# EAGLE schematic Motorsystem (EAGLE 9.5.2)

## Sheet 1 of 2
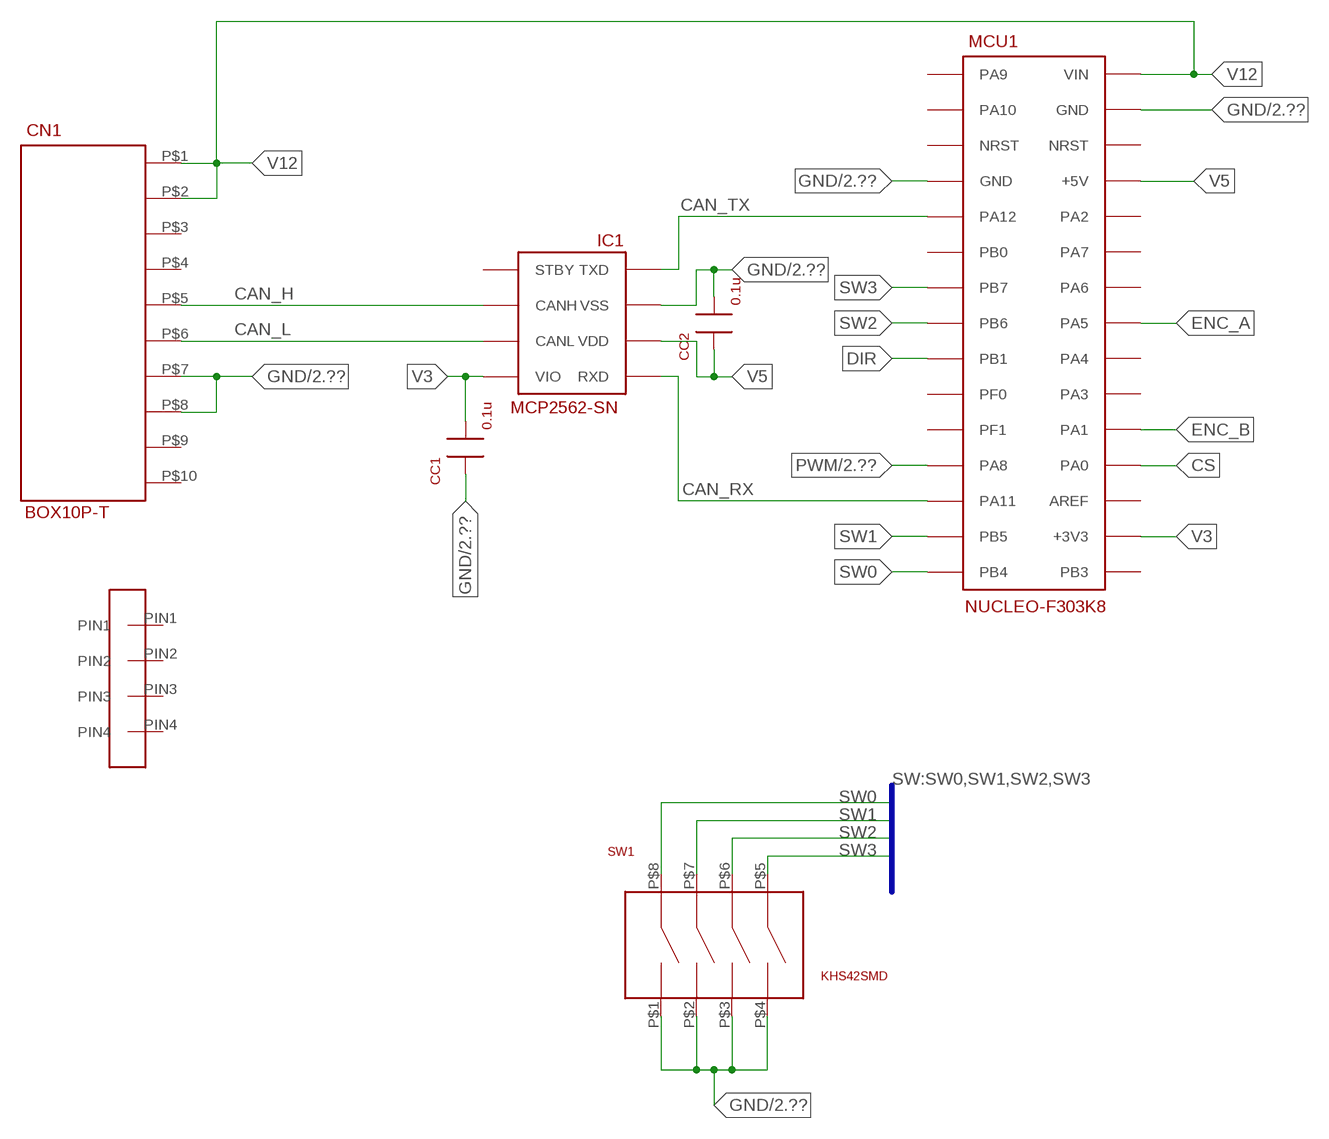
[diagram p0: schematic, sheet 1]

### Parts
CC1  0.1u  MLCC1608  [C1608]
CC2  0.1u  MLCC1608  [C1608]
CN1  BOX10P-T  [BOX10P-T]
IC1  MCP2562-SN  [SOIC8]
MCU1  NUCLEO-F303K8  [NUCLEO-NANO]
SW1  KHS42SMD  [KHS42]
U$3  DF1B_L_4P  [DF1B_L_4P]

### Nets
CAN_H [signal]: CN1.P$5 IC1.P$7(CANH)
CAN_L [signal]: CN1.P$6 IC1.P$6(CANL)
CAN_RX [signal]: IC1.P$4(RXD) MCU1.P$13(PA11)
CAN_TX [signal]: IC1.P$1(TXD) MCU1.P$5(PA12)
CS: MCU1.P$19(PA0)
DIR [signal]: MCU1.P$9(PB1)
ENC_A: MCU1.P$23(PA5)
ENC_B: MCU1.P$20(PA1)
GND [GND]: CC1.P$1 CC2.P$2 CN1.P$7 CN1.P$8 IC1.P$2(VSS) MCU1.P$4(GND) MCU1.P$29(GND) SW1.P$1 SW1.P$2 SW1.P$3 SW1.P$4 ; also sheet 2
PWM: MCU1.P$12(PA8) ; also sheet 2
SW0: MCU1.P$15(PB4) SW1.P$8
SW1: MCU1.P$14(PB5) SW1.P$7
SW2: MCU1.P$8(PB6) SW1.P$6
SW3: MCU1.P$7(PB7) SW1.P$5
V3 [Power]: CC1.P$2 IC1.P$5(VIO) MCU1.P$17(+3V3)
V5 [Power]: CC2.P$1 IC1.P$3(VDD) MCU1.P$27(+5V)
V12 [Power]: CN1.P$1 CN1.P$2 MCU1.P$30(VIN)
Unconnected: CN1.P$3 CN1.P$4 CN1.P$9 CN1.P$10 IC1.P$8(STBY) MCU1.P$1(PA9) MCU1.P$2(PA10) MCU1.P$3(NRST) MCU1.P$6(PB0) MCU1.P$10(PF0) MCU1.P$11(PF1) MCU1.P$16(PB3) MCU1.P$18(AREF) MCU1.P$21(PA3) MCU1.P$22(PA4) MCU1.P$24(PA6) MCU1.P$25(PA7) MCU1.P$26(PA2) MCU1.P$28(NRST) U$3.PIN1 U$3.PIN2 U$3.PIN3 U$3.PIN4

### Buses
SW:SW0,SW1,SW2,SW3

## Sheet 2 of 2
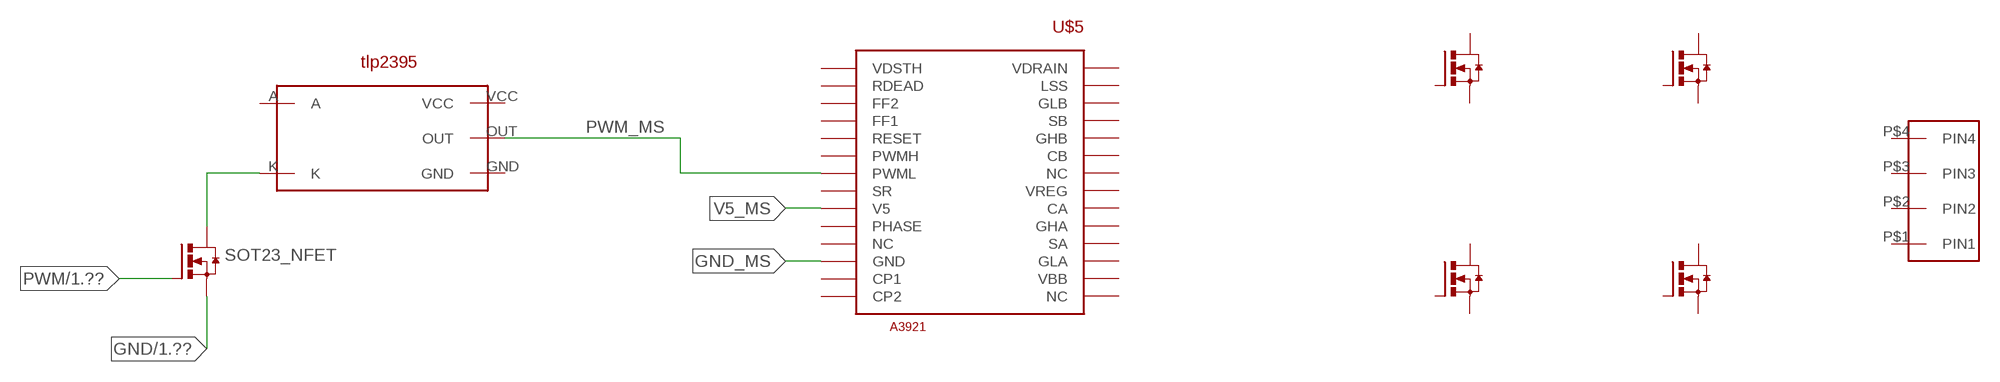
[diagram p1: schematic, sheet 2]

### Parts
U$1  TLP2395  [TLP2395]
U$2  SOT23_NFET  [SOT23_NFET]
U$4  NP52N06SLG  [NP52N06SLG]
U$5  A3921  [A3921]
U$6  NP52N06SLG  [NP52N06SLG]
U$7  NP52N06SLG  [NP52N06SLG]
U$8  NP52N06SLG  [NP52N06SLG]
U$9  VL_4P  [VL_4P]

### Nets
GND [GND]: U$2.PIN2_S ; also sheet 1
GND_MS: U$5.PAD(GND) U$5.PIN17(GND)
N$1: U$1.K U$2.PIN3_D
PWM: U$2.PIN1_G ; also sheet 1
PWM_MS: U$1.OUT U$5.PIN22(PWML)
V5_MS: U$5.PIN20(V5)
Unconnected: U$1.A U$1.GND U$1.VCC U$4.PIN1_G U$4.PIN2_D U$4.PIN3_S U$5.PIN1(VDRAIN) U$5.PIN2(LSS) U$5.PIN3(GLB) U$5.PIN4(SB) U$5.PIN5(GHB) U$5.PIN6(CB) U$5.PIN7(NC) U$5.PIN8(VREG) U$5.PIN9(CA) U$5.PIN10(GHA) U$5.PIN11(SA) U$5.PIN12(GLA) U$5.PIN13(VBB) U$5.PIN14(NC) U$5.PIN15(CP2) U$5.PIN16(CP1) U$5.PIN18(NC) U$5.PIN19(PHASE) U$5.PIN21(SR) U$5.PIN23(PWMH) U$5.PIN24(RESET) U$5.PIN25(FF1) U$5.PIN26(FF2) U$5.PIN27(RDEAD) U$5.PIN28(VDSTH) U$6.PIN1_G U$6.PIN2_D U$6.PIN3_S U$7.PIN1_G U$7.PIN2_D U$7.PIN3_S U$8.PIN1_G U$8.PIN2_D U$8.PIN3_S U$9.P$1(PIN1) U$9.P$2(PIN2) U$9.P$3(PIN3) U$9.P$4(PIN4)

## Library data of the parts
CC1 CC2 = capacitor:MLCC
CN1 = connectors:BOX10P
IC1 = Microchip:MCP2562
MCU1 = Nucleo:NUCLEO-F303K8
SW1 = switch:KHS42
U$1 = user:TLP2395: 高速フォトカプラ ステートバッファ出力 100nSほどの遅延 RS品番885-1171
U$2 = user:SOT23_NFET
U$3 = user:DF1B_L_4P
U$4 U$6-U$8 = user:NP52N06SLG: 秋月電子通商 I-09928 TO252
U$5 = user:A3921: ブラシ付きモーター用ゲートドライバ フルブリッジ駆動
U$9 = user:VL_4P